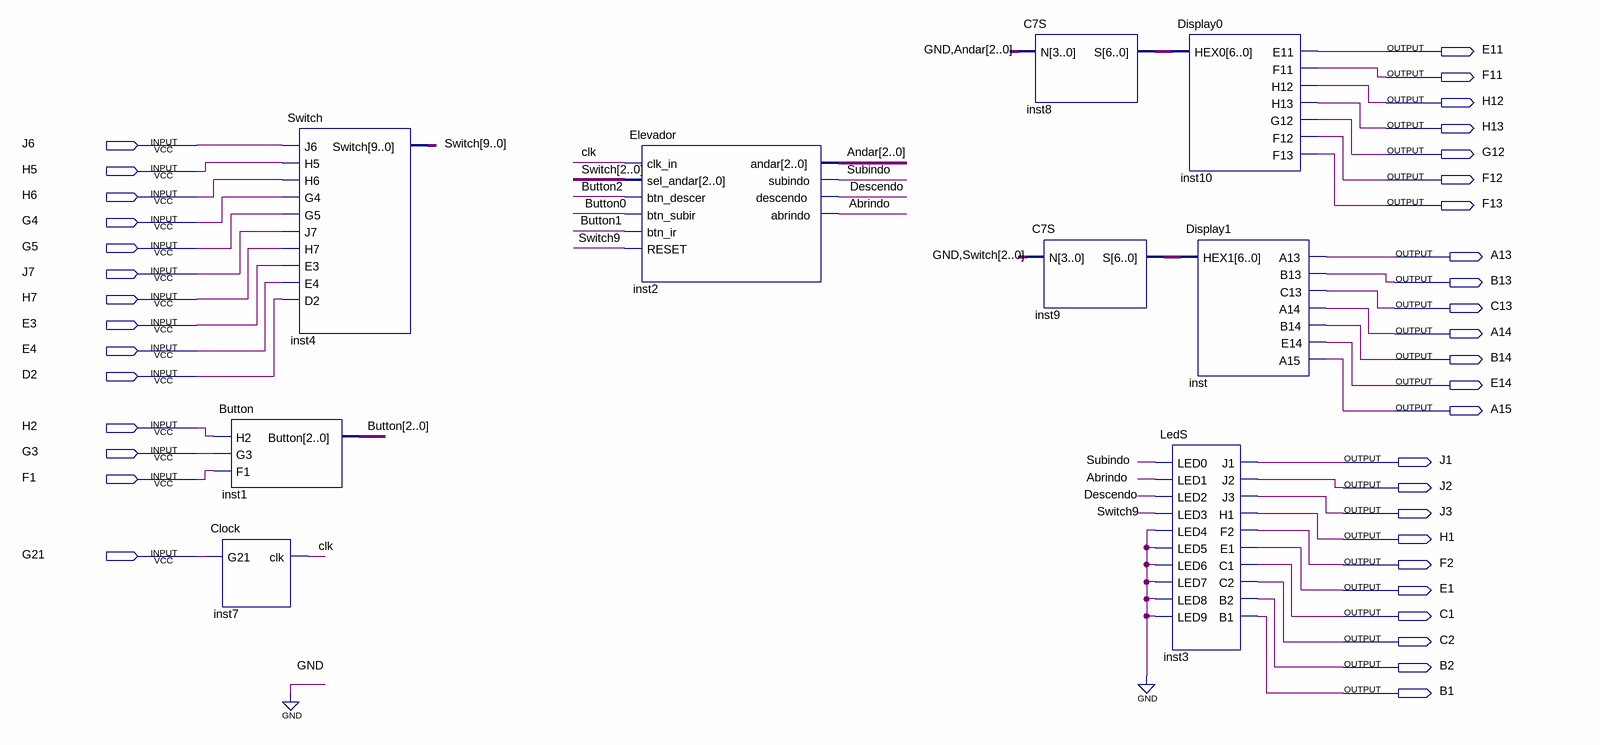
[diagram p0: schematic sheet]
// Quartus schematic Elevador_TL.bdf as structural Verilog: 9 symbols, 38 pins
module Elevador_TL (
  input  J6,
  input  H5,
  input  H6,
  input  G4,
  input  G5,
  input  J7,
  input  H7,
  input  E3,
  input  E4,
  input  D2,
  input  H2,
  input  G3,
  input  F1,
  input  G21,
  output E11,
  output F11,
  output H12,
  output H13,
  output G12,
  output F12,
  output F13,
  output A13,
  output B13,
  output C13,
  output A14,
  output B14,
  output E14,
  output A15,
  output J1,
  output J2,
  output J3,
  output H1,
  output F2,
  output E1,
  output C1,
  output C2,
  output B2,
  output B1
);

  wire Abrindo, clk, Descendo, Subindo;
  wire [2:0] Andar, Button;
  wire [6:0] inst8_s, inst9_s;
  wire [9:0] Switch;

  Button inst1 (.H2(H2), .G3(G3), .F1(F1), .Button(Button));
  Clock inst7 (.G21(G21), .clk(clk));
  Switch inst4 (
    .J6(J6), .H5(H5), .H6(H6), .G4(G4), .G5(G5), .J7(J7), .H7(H7), .E3(E3), .E4(E4), .D2(D2), .Switch(Switch));
  Elevador inst2 (
    .clk_in(clk), .sel_andar(Switch[2:0]), .btn_descer(Button[2]), .btn_subir(Button[0]), .btn_ir(Button[1]),
    .RESET(Switch[9]), .andar(Andar), .subindo(Subindo), .descendo(Descendo), .abrindo(Abrindo));
  C7S inst8 (.N({1'b0, Andar}), .S(inst8_s));
  C7S inst9 (.N({1'b0, Switch[2:0]}), .S(inst9_s));
  Display0 inst10 (.HEX0(inst8_s), .E11(E11), .F11(F11), .H12(H12), .H13(H13), .G12(G12), .F12(F12), .F13(F13));
  Display1 inst (.HEX1(inst9_s), .A13(A13), .B13(B13), .C13(C13), .A14(A14), .B14(B14), .E14(E14), .A15(A15));
  LedS inst3 (
    .LED0(Subindo), .LED1(Abrindo), .LED2(Descendo), .LED3(Switch[9]), .LED4(1'b0), .LED5(1'b0), .LED6(1'b0),
    .LED7(1'b0), .LED8(1'b0), .LED9(1'b0), .J1(J1), .J2(J2), .J3(J3), .H1(H1), .F2(F2), .E1(E1), .C1(C1),
    .C2(C2), .B2(B2), .B1(B1));
endmodule
